# EAGLE design bmp co spg new (EAGLE 9.6.2)
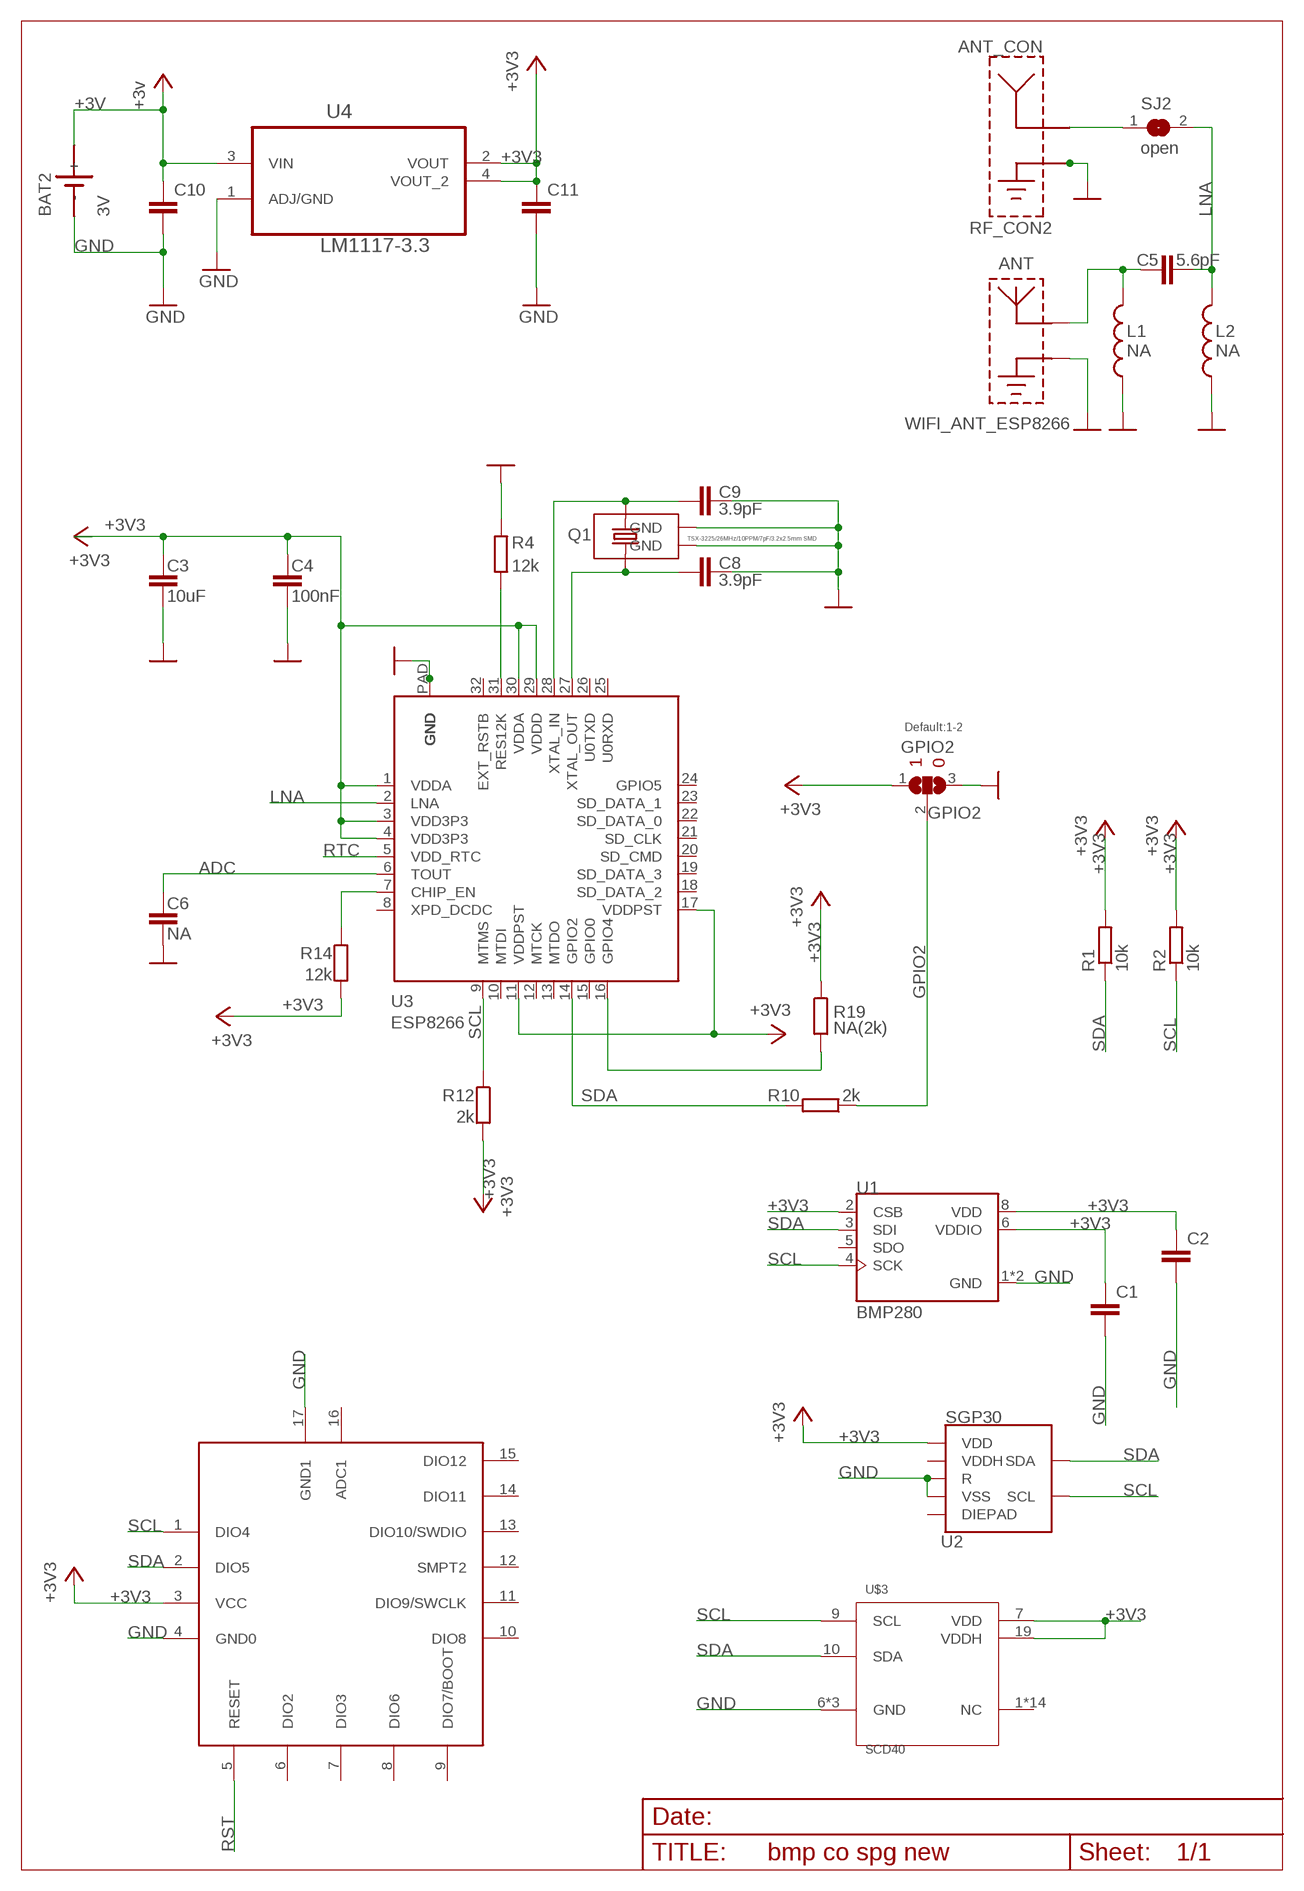
[diagram p0: schematic, sheet 1]

## Parts
ANT  WIFI_ANT_ESP8266  [ESP8266_ANT]
ANT_CON  RF_CON2  [RF_CONNECTOR_I-PEX_NO_CREAM]
BAT2  3V  SN2032  [SN2032]
C1  100nF  C-EUC1206  [C1206]
C2  100nF  C-EUC1206  [C1206]
C3  10uF  C-EUC0603_DWS  [C0603_DWS]
C4  100nF  C-EUC0402_TI  [C0402_TI]
C5  5.6pF  C-EUC0402_TI  [C0402_TI]
C6  NA  C-EUC0402_TI  [C0402_TI]
C8  3.9pF  C-EUC0402_TI  [C0402_TI]
C9  3.9pF  C-EUC0402_TI  [C0402_TI]
C10  47u  C-EUC1206  [C1206]
C11  10u  C-EUC1206  [C1206]
GPIO2  Default:1-2  SJ2W4  [SJ_2_SMALLER]
L1  NA  L-USL0402_TI  [L0402_TI]
L2  NA  L-USL0402_TI  [L0402_TI]
Q1  TSX-3225/26MHz/10PPM/7pF/3.2x2.5mm SMD  SMALL_SMD_CRYSTAL_1  [NX3225SA]
R1  10k  R-EU_R0402  [R0402]
R2  10k  R-EU_R0402  [R0402]
R4  12k  R-EU_R0402_TI  [R0402_TI]
R10  2k  R-EU_R0402_TI  [R0402_TI]
R12  2k  R-EU_R0402_TI  [R0402_TI]
R14  12k  R-EU_R0402_TI  [R0402_TI]
R19  NA(2k)  R-EU_R0402_TI  [R0402_TI]
SJ2  open  SJSJ_SMALLER  [SJ_1_SMALLER]
U1  BMP280  [XDCR_BMP280]
U2  SGP30  [SGP30]
U3  ESP8266  [QFN32_PAD]
U4  LM1117-3.3  [SOT230]
U$1  BLUENRG-234BLEMODULE  [BLUENRG-234BLEMODULE]
U$3  SCD40  [SCD4X]

## Nets
+3V [supply]: BAT2.+ C10.1 U4.3(VIN) ; supply symbol labelled +3v
+3V3 [supply]: C1.1 C2.1 C3.1 C4.1 C11.1 GPIO2.1 R1.2 R2.2 R12.2 R14.2 R19.1 U1.2(CSB) U1.6(VDDIO) U1.8(VDD) U2.1(VDD) U3.1(VDDA) U3.3(VDD3P3) U3.4(VDD3P3) U3.11(VDDPST) U3.17(VDDPST) U3.29(VDDD) U3.30(VDDA) U4.2(VOUT) U4.4(VOUT_2) U$1.3(VCC) U$3.7(VDD) U$3.19(VDDH)
ADC: C6.1 U3.6(TOUT)
GND: ANT.GND ANT_CON.1(GND_1) ANT_CON.2(GND_2) BAT2.- C1.2 C2.2 C3.2 C4.2 C6.2 C8.1 C9.1 C10.2 C11.2 GPIO2.3 L1.1 L2.1 Q1.NC_1(GND) Q1.NC_2(GND) R4.2 U1.1(GND) U1.7(GND) U2.2(VSS) U2.4(R) U3.P$1(GND) U3.P$2(GND) U3.P$3(GND) U3.P$4(GND) U3.P$5(GND) U3.P$6(GND) U3.P$7(GND) U3.P$8(GND) U3.P$9(GND) U3.PAD(GND) U4.1(ADJ/GND) U$1.4(GND0) U$1.17(GND1) U$3.6(GND) U$3.20(GND) U$3.21(GND)
GPIO2: GPIO2.2 R10.1
GPIO4: R19.2 U3.16(GPIO4)
LNA: C5.2 L2.2 SJ2.2 U3.2(LNA)
N$7: ANT_CON.ANT SJ2.1
N$11: R14.1 U3.7(CHIP_EN)
N$14: ANT.ANT C5.1 L1.2
N$21: C8.2 Q1.2 U3.27(XTAL_OUT)
N$22: R4.1 U3.31(RES12K)
N$23: C9.2 Q1.1 U3.28(XTAL_IN)
RST: U$1.5(RESET)
RTC: U3.5(VDD_RTC)
SCL: R2.1 R12.1 U1.4(SCK) U2.6(SCL) U3.9(MTMS) U$1.1(DIO4) U$3.9(SCL)
SDA: R1.1 R10.2 U1.3(SDI) U2.3(SDA) U3.14(GPIO2) U$1.2(DIO5) U$3.10(SDA)
Unconnected: U1.5(SDO) U2.5(VDDH) U2.DIEPAD U3.8(XPD_DCDC) U3.10(MTDI) U3.12(MTCK) U3.13(MTDO) U3.15(GPIO0) U3.18(SD_DATA_2) U3.19(SD_DATA_3) U3.20(SD_CMD) U3.21(SD_CLK) U3.22(SD_DATA_0) U3.23(SD_DATA_1) U3.24(GPIO5) U3.25(U0RXD) U3.26(U0TXD) U3.32(EXT_RSTB) U$1.6(DIO2) U$1.7(DIO3) U$1.8(DIO6) U$1.9(DIO7/BOOT) U$1.10(DIO8) U$1.11(DIO9/SWCLK) U$1.12(SMPT2) U$1.13(DIO10/SWDIO) U$1.14(DIO11) U$1.15(DIO12) U$1.16(ADC1) U$3.1(NC) U$3.2(NC) U$3.3(NC) U$3.4(NC) U$3.5(NC) U$3.8(NC) U$3.11(NC) U$3.12(NC) U$3.13(NC) U$3.14(NC) U$3.15(NC) U$3.16(NC) U$3.17(NC) U$3.18(NC)

## Notes on the sheet
- 1 | 0

## Library data of the parts
ANT = OLIMEX_ANT:WIFI_ANT_ESP8266
ANT_CON = OLIMEX_CONNECTORS:RF_CON
BAT2 = sn2032:SN2032: LI BATTERY
C1 C2 C10 C11 = rcl:C-EU: CAPACITOR, European symbol; SPICEPREFIX: C
C3-C6 C8 C9 = rcl:C-EU: CAPACITOR, European symbol
GPIO2 = jumper:SJ2W: SMD solder JUMPER
L1 L2 = rcl:L-US: INDUCTOR, American symbol
Q1 = OLIMEX_DISCRET:SMALL_SMD_CRYSTAL
R1 R2 = rcl:R-EU_: RESISTOR, European symbol; SPICEPREFIX: R
R4 R10 R12 R14 R19 = rcl:R-EU_: RESISTOR, European symbol
SJ2 = jumper:SJ: SMD solder JUMPER
U1 = BMP280:BMP280: BMP280 Absolute Barometric Pressure Sensor for Battery Powered Devices 2 x 2.5mm Check availability <https://pricing.snapeda.com/parts/BMP280/Bosch/view-part?ref=eda>; AVAILABILITY: In Stock; DESCRIPTION: Pressure Sensor 4.35PSI ~ 15.95PSI (30kPa ~ 110kPa) Absolute - 16b 8-SMD; MF: Bosch; MP: BMP280; PACKAGE: LGA-8 Bosch Tools; PRICE: None; PURCHASE-URL: https://pricing.snapeda.com/search/part/BMP280/?ref=eda
U2 = SGP30:SGP30: The SGP30 is a digital multi-pixel gas sensor designed for easy integration into air purifier, demand-controlled ventilation, and IoT applications. Check availability <https://pricing.snapeda.com/parts/SGP30/Sensirion%20AG/view-part?ref=eda>; AVAILABILITY: In Stock; DESCRIPTION: SGP30, SHTC1 Air Quality, Humidity, Temperature Sensor Arduino Platform Evaluation Expansion Board; MF: Sensirion AG; MP: SGP30; PACKAGE: None; PRICE: None
U3 = OLIMEX_IC:ESP8266
U4 = LM1117-3.3:LM1117-3.3: IC REG LDO 800MA 3.3V Check prices <https://pricing.snapeda.com/parts/LM1117-3.3/Texas%20Instruments/view-part?ref=eda>; AVAILABILITY: In Stock; DESCRIPTION: Linear Voltage Regulator IC Positive Fixed 1 Output 800mA DDPAK/TO-263-3; MF: Texas Instruments; MP: LM1117-3.3; PACKAGE: None; PRICE: None
U$1 = BLUENRG-234blemodule:BLUENRG-234BLEMODULE: BLUENRG-234 BLE Module
U$3 = SCD40-D-R1:SCD40

## Net classes
1 supply: width 0.406 mm, clearance 0.203 mm

## Board
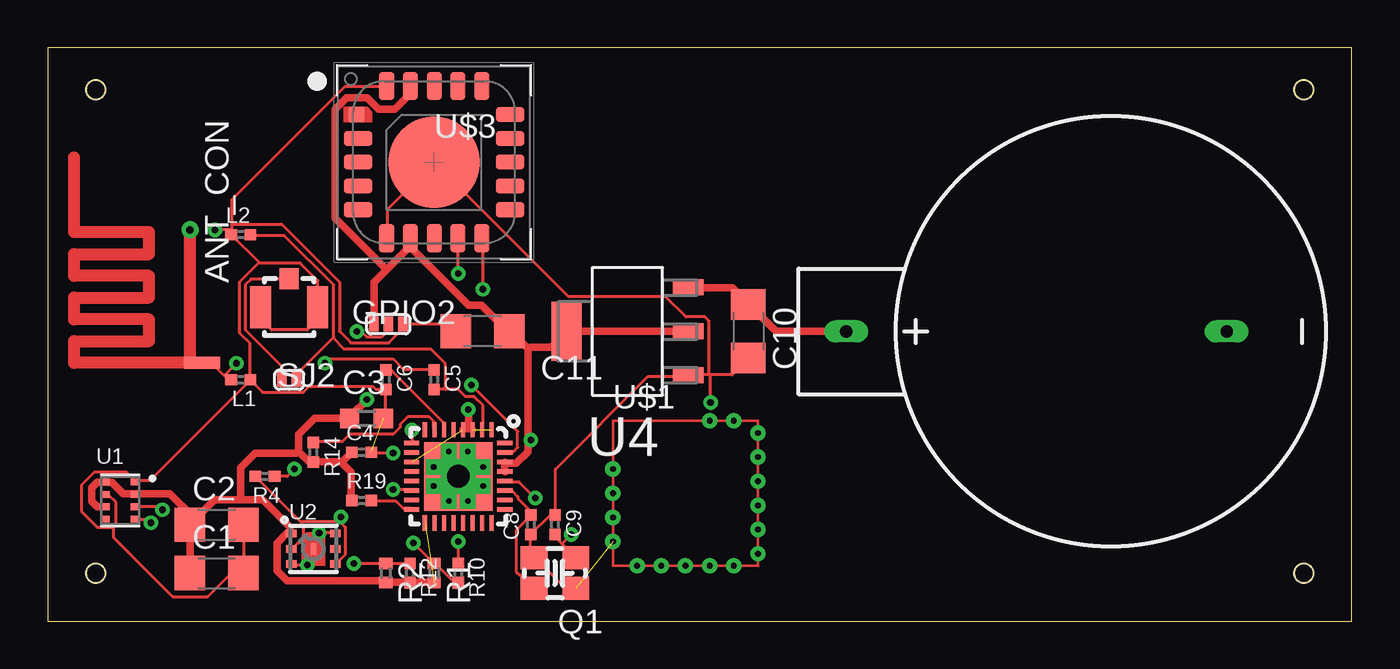
[diagram p1: board, top side]
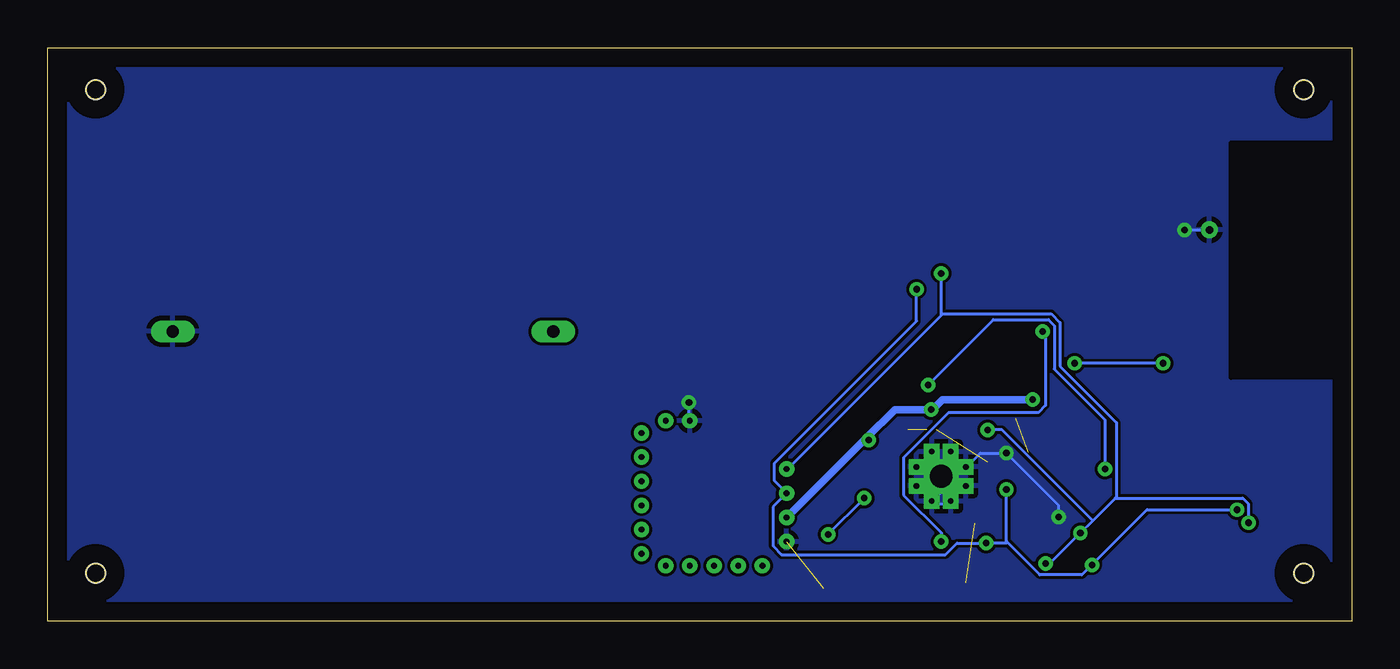
[diagram p2: board, bottom side, seen from below]

Size 68.56 x 30.15 mm. Coordinates in mm from the lower left corner, seen from the top.
Outline: 2.04,2.51 arc174 3.04,2.51 3.04,2.57 arc174 2.04,2.57 2.04,2.51
Outline: 2.04,27.91 arc174 3.04,27.91 3.04,27.97 arc174 2.04,27.97 2.04,27.91
Outline: 65.54,27.91 arc174 66.54,27.91 66.54,27.97 arc174 65.54,27.97 65.54,27.91
Outline: 65.54,2.51 arc174 66.54,2.51 66.54,2.57 arc174 65.54,2.57 65.54,2.51
Outline: 0,30.15 0,0 68.56,0 68.56,30.15 0,30.15
Copper layers (1*16): Top 0.035mm / dielectric 1.5mm / Bottom 0.035mm
Design rules "default": minimum track width 6mil, minimum drill 0.35mm, track to track 6mil, track to pad 6mil, pad to pad 6mil, via to via 6mil, smd to smd 6mil, copper to edge 40mil, drill to drill 6mil, minimum pad ring 10mil, minimum via ring 8mil, stop-mask expansion 4mil, vias tented up to drill 0mil, thermal gap 10mil
Holes 1 mm at 2.54,2.54 2.54,27.94 66.04,27.94 66.04,2.54

### Footprints (pad centres in the part's own frame; a part is rotated, then mirrored left to right if it is on the bottom)
ESP8266_ANT = smd 0.635 x 1.905: ANT -5.334,-3.302 | drill 0.4 pad 0.635: GND 1.651,-2.667
RF_CONNECTOR_I-PEX_NO_CREAM = smd 2.2 x 1.1: 1 0,1.5; 2 0,-1.5 | smd 1.1 x 1: ANT 1.5,0
SN2032 = drill 0.65 long: + 0,13.9; - 0,-6.1
C1206 = smd 1.6 x 1.8: 1 -1.4,0; 2 1.4,0
C0603_DWS = smd 1.016 x 1.016: 1 -0.889,0; 2 0.889,0
C0402_TI = smd 0.61 x 0.584: 1 -0.508,0; 2 0.508,0
SJ_2_SMALLER = smd 0.508 x 0.762: 1 -0.762,0; 2 0,0; 3 0.762,0
L0402_TI = smd 0.61 x 0.584: 1 -0.508,0; 2 0.508,0
NX3225SA = smd 1.4 x 1.2: 1 -1.1,-0.8; 2 1.1,0.8; NC_1 1.1,-0.8; NC_2 -1.1,0.8
R0402 = smd 0.6 x 0.7: 1 -0.5,0; 2 0.5,0
R0402_TI = smd 0.61 x 0.584: 1 -0.508,0; 2 0.508,0
SJ_1_SMALLER = smd 0.508 x 0.762: 1 -0.381,0; 2 0.381,0
XDCR_BMP280 = smd 0.5 x 0.35: 1 0.8,0.975; 2 0.8,0.325; 3 0.8,-0.325; 4 0.8,-0.975; 5 -0.8,-0.975; 6 -0.8,-0.325; 7 -0.8,0.325; 8 -0.8,0.975
SGP30 = smd 0.55 x 0.4: 1 -1.15,0.8; 2 -1.15,0; 3 -1.15,-0.8; 4 1.15,-0.8; 5 1.15,0; 6 1.15,0.8 | smd 0.305 x 0.61: DIEPAD 0,0
QFN32_PAD = smd 0.8 x 0.23: 1 -2.45,1.75; 2 -2.45,1.25; 3 -2.45,0.75; 4 -2.45,0.25; 5 -2.45,-0.25; 6 -2.45,-0.75; 7 -2.45,-1.25; 8 -2.45,-1.75; 17 2.45,-1.75; 18 2.45,-1.25; 19 2.45,-0.75; 20 2.45,-0.25; 21 2.45,0.25; 22 2.45,0.75; 23 2.45,1.25; 24 2.45,1.75 | smd 0.23 x 0.8: 9 -1.75,-2.45; 10 -1.25,-2.45; 11 -0.75,-2.45; 12 -0.25,-2.45; 13 0.25,-2.45; 14 0.75,-2.45; 15 1.25,-2.45; 16 1.75,-2.45; 25 1.75,2.45; 26 1.25,2.45; 27 0.75,2.45; 28 0.25,2.45; 29 -0.25,2.45; 30 -0.75,2.45; 31 -1.25,2.45; 32 -1.75,2.45 | drill 1.2 pad 1.422 square: P$1 0,0 | drill 0.3 pad 0.4 square: P$2 0.5,1.3; P$3 -0.5,1.3; P$4 -1.3,0.5; P$5 -1.3,-0.5; P$6 -0.5,-1.3; P$7 0.5,-1.3; P$8 1.3,-0.5; P$9 1.3,0.5 | smd 3.6 x 3.6: PAD 0,0
SOT230 = smd 1.6 x 0.838: 1 -3.2,2.311; 2 -3.2,0; 3 -3.2,-2.311 | smd 1.6 x 3.099: 4 3.2,0
BLUENRG-234BLEMODULE = drill 0.3 pad 0.813: 1 -3.81,1.27 | drill 0.3: 2 -3.81,0; 3 -3.81,-1.27; 4 -3.81,-2.54; 5 -2.54,-3.81; 6 -1.27,-3.81; 7 0,-3.81; 8 1.27,-3.81; 9 2.54,-3.81; 10 3.81,-3.175; 11 3.81,-1.905; 12 3.81,-0.635; 13 3.81,0.635; 14 3.81,1.905; 15 3.81,3.175; 16 2.54,3.81; 17 1.27,3.81
SCD4X = smd 0.8 x 0.8: 1 -4.075,2.5 | smd 1.5 x 0.8: 2 -4,1.25; 3 -4,0; 4 -4,-1.25; 5 -4,-2.5; 11 4,-2.5; 12 4,-1.25; 13 4,0; 14 4,1.25; 15 4,2.5 | smd 0.8 x 1.5: 6 -2.5,-4; 7 -1.25,-4; 8 0,-4; 9 1.25,-4; 10 2.5,-4; 16 2.5,4; 17 1.25,4; 18 0,4; 19 -1.25,4; 20 -2.5,4 | smd 4.8 x 4.8: 21 0,0

### Placement (x,y rotation side)
ANT  4.83,18.92 90 top
ANT_CON  12.7,16.51 90 top
BAT2  55.88,15.24 90 top
C1  8.89,2.54 0 top
C2  8.89,5.08 0 top
C3  16.76,10.67 0 top
C4  16.51,8.89 0 top
C5  20.32,12.7 270 top
C6  17.78,12.7 270 top
C8  25.4,5.08 90 top
C9  26.67,5.08 270 top
C10  36.83,15.24 270 top
C11  22.86,15.24 180 top
GPIO2  17.91,15.62 0 top
L1  10.16,12.7 180 top
L2  10.16,20.32 0 top
Q1  26.67,2.54 180 top
R1  20.32,2.54 270 top
R2  17.78,2.54 270 top
R4  11.43,7.62 180 top
R10  21.59,2.54 270 top
R12  19.05,2.54 270 top
R14  13.97,8.89 270 top
R19  16.51,6.35 0 top
SJ2  12.7,12.7 0 top
U1  3.81,6.35 0 top
U2  13.97,3.81 0 top
U3  21.59,7.62 270 top
U4  30.48,15.24 180 top
U$1  33.53,6.73 0 top
U$3  20.32,24.13 0 top

### Tracks (layer width: path | path; a pad name or v marks a point on that pad's centre or on a via)
+3V
  Top 0.406: U4.3 33.71,17.53 35.99,17.53 36.83,16.69 C10.1 36.98,16.54 38.28,15.24 BAT2.+
+3V3  (via drill 0.35)  (3 unrouted)
  Top 0.406: 15.49,8.38 R14.2 13.82,8.31 13.21,8.91 | C4.1 15.49,8.38 | R19.1 15.95,6.4 15.95,7.85 15.57,8.23 15.49,8.38 | 13.21,8.91 13.21,9.83 14.05,10.67 C3.1 15.95,10.82 v16.79,11.66 | U1.6 3,6.02 2.62,6.02 2.31,6.33 2.31,7.01 2.62,7.32 3,7.32 U1.8 3.15,7.32 3.38,7.32 3.99,6.71 4.6,6.71 U1.2 4.75,6.71 6.43,6.71 7.64,5.49 C2.1 | R1.2 20.3,2.06 19.07,2.06 R12.2 18.92,2.06 17.78,2.06 R2.2 17.63,2.13 12.6,2.13 12.07,2.67 12.07,4.12 12.6,4.65 U2.1 12.75,4.65 12.75,4.95 11.3,6.4 10.16,6.4 | 10.16,6.4 8.79,6.4 7.49,5.11 C2.1 | C1.1 7.49,2.59 7.49,4.88 C2.1 | 10.16,6.4 10.16,8.08 10.92,8.84 13.06,8.84 13.21,8.91 | 17.82,18.48 19,19.66 19,20.12 U$3.7 19.15,19.58 22.12,16.61 22.81,16.61 24.11,15.32 C11.1 24.33,15.24 25.25,14.33 | 17.82,18.48 17.17,17.83 17.17,15.62 GPIO2.1 | 17.82,18.48 15.11,21.18 15.11,26.9 15.72,27.51 16.79,27.51 17.4,26.9 18.24,26.9 19,27.66 19,28.12 U$3.19 | 22.12,10.13 22.28,10.13 U3.3 | 22.12,10.13 21.89,10.13 U3.4 | v22.12,11.12 22.12,10.13 | U3.29 24.03,7.92 24.03,8.31 U3.30 24.18,8.31 24.64,8.31 25.25,8.91 25.25,9.53 | 25.25,14.33 25.25,9.53 | U4.2 U4.4 27.15,15.09 26.47,14.4 25.4,14.4 25.25,14.33 | v25.4,9.53 25.25,9.53
  Bottom 0.406: 25.51,9.64 29.67,5.49 U$1.3 | 25.51,9.64 24.03,11.12 v22.12,11.12 21.97,11.2 21.51,11.66 v16.79,11.66 | v25.4,9.53 25.51,9.64
ADC
  Top 0.152: C6.1 17.78,13.18 18.09,13.18 20.83,10.44 20.83,10.13 U3.6
GND  (via drill 0.35)  (2 unrouted)
  Top 0.152: U$3.6 17.86,20.19 17.86,21.64 20.3,24.08 U$3.21 27.38,17.07 32.49,17.07 33.55,16 34.54,16 34.77,15.77 34.77,12.95 | 34.85,12.95 35.99,12.95 36.83,13.79 C10.2 | 34.85,12.95 34.77,12.95 | 34.77,12.95 33.71,12.95 U4.1 33.63,12.88 31.57,12.88 26.7,8 26.7,5.64 C9.1 26.62,5.56 26.39,5.56 C8.1 25.4,3.5 25.55,3.35 Q1.NC_1 25.63,3.35 27.23,1.75 27.76,1.75 Q1.NC_2 | R4.2 13.32,5.22 | 13.32,5.22 13.44,5.11 13.44,4.34 13.21,4.12 13.13,4.12 U2.2 | 15.38,5.22 15.34,5.26 13.36,5.26 13.32,5.22 | 15.38,5.22 15.65,4.95 15.65,3.5 15.19,3.05 U2.4 | v18.16,8.84 17.02,8.84 C4.2 | v15.42,5.49 15.42,5.26 15.38,5.22 | C2.2 10.31,5.03 10.31,2.59 C1.2 10.24,2.52 9.63,2.52 8.41,1.29 6.58,1.29 3.45,4.42 3.45,4.95 3.42,4.99 | C11.2 21.44,15.24 21.06,15.62 GPIO2.3 18.62,15.62 18.62,15.32 17.93,14.63 15.95,14.63 15.34,15.24 15.34,17.83 12.29,20.88 9.7,20.88 | 3.42,4.99 3.38,4.95 2.62,4.95 1.78,5.79 1.78,7.16 2.46,7.85 4.14,7.85 4.6,7.39 U1.1 4.67,7.39 5.36,7.39 L1.1 | 3.42,4.99 3.61,5.18 3.61,6.25 3.23,6.63 3.07,6.63 U1.7 | C3.2 17.7,10.67 17.78,10.74 C6.2 17.25,12.19 17.09,12.34 13.74,12.34 13.44,12.04 11.3,12.04 10.69,12.65 L1.1 | 11.11,18.86 11.15,18.82 13.28,18.82 14.2,17.91 14.2,16.54 ANT_CON.2 14.2,16.46 14.2,15.85 13.67,15.32 11.76,15.32 11.23,15.85 11.23,16.46 ANT_CON.1 | 11.11,18.86 L2.1 | 11.11,18.86 10.08,17.83 10.08,15.16 10.62,14.63 10.62,12.72 L1.1 | 9.7,20.57 9.7,20.34 L2.1 | 9.7,20.57 9.7,20.88 | 9.7,20.88 9.7,22.17 15.65,28.12 17.78,28.12 U$3.20 | 9.7,20.57 v8.79,20.57 | 9.7,20.57 L2.1 | v34.85,11.51 34.85,12.95
  Bottom 0.152: U3.P$6 20.22,8.15 19.53,8.84 v18.16,8.84 15.42,6.1 v15.42,5.49 | U3.P$1 21.59,6.78 21.89,6.48 22.28,6.48 22.28,6.4 21.82,6.4 21.82,6.48 21.89,6.55 22.28,6.55 22.35,6.48 22.35,6.17 21.29,6.17 21.13,6.02 20.98,6.02 20.83,6.17 20.83,6.48 20.9,6.55 21.13,6.55 21.21,6.48 21.21,6.4 21.36,6.4 21.36,6.48 21.29,6.55 21.21,6.55 21.13,6.48 21.13,6.33 U3.P$8 | v8.79,20.57 ANT.GND | v34.85,11.51 34.85,10.59 U$1.17
  pour Bottom: -3.81,48.26 -3.81,-3.81 72.39,-3.81 72.39,48.26
GPIO2  (via drill 0.35)
  Top 0.152: v21.59,4.19 R10.1 | v16.26,15.24 16.48,15.24 16.79,14.94 17.55,14.94 17.86,15.24 17.86,15.62 GPIO2.2
  Bottom 0.152: v21.59,4.19 21.59,4.65 23.57,6.63 23.57,8.61 21.21,10.97 16.48,10.97 16.1,11.35 16.1,15.09 v16.26,15.24
GPIO4
  Top 0.152: R19.2 17.02,6.33 18.31,6.33 18.69,5.94 19.07,5.94 U3.16
LNA
  Top 0.152: 20.9,12.19 21.59,12.19 21.97,11.81 22.43,11.81 22.89,11.35 22.89,10.13 U3.2 | 20.9,12.19 C5.2 | 15,14.9 13.13,13.03 13.13,12.72 SJ2.2 | 15,14.9 15.04,14.94 15.04,17.68 12.45,20.27 10.69,20.27 L2.2 | 20.9,12.19 20.9,13.56 20.14,14.33 15.57,14.33 15,14.9
N$7
  Top 0.152: SJ2.1 12.29,12.72 12.29,13.41 10.39,15.32 10.39,17.68 10.69,17.98 12.68,17.98 ANT_CON.ANT
N$11
  Top 0.152: R14.1 13.97,9.45 15.49,9.45 15.88,9.83 18.16,9.83 18.54,10.21 18.54,10.36 18.92,10.74 20.07,10.74 20.3,10.52 20.3,10.13 U3.7
N$14  (via drill 0.35)
  Top 0.152: 9.28,12.92 8.64,13.56 8.18,13.56 ANT.ANT | 9.28,12.92 9.47,12.72 9.63,12.72 L1.2 | v14.58,13.56 14.81,13.79 18.16,13.79 18.69,13.26 20.3,13.26 C5.1 | 9.28,12.92 v9.93,13.56
  Bottom 0.152: v9.93,13.56 v14.58,13.56
N$21
  Top 0.152: U3.27 24.11,6.86 24.41,6.86 24.71,6.55 24.71,6.48 25.4,5.79 C8.2 25.4,5.56 24.64,4.8 24.64,2.59 24.79,2.44 24.87,2.44 25.55,1.75 Q1.2
N$22  (via drill 0.35)
  Top 0.152: R4.1 12.6,7.62 v12.98,8 | v22.28,12.42 24.71,9.98 24.71,9.14 24.49,8.91 24.11,8.91 U3.31
  Bottom 0.152: v12.98,8 12.98,10.59 15.65,13.26 15.65,15.54 15.95,15.85 18.85,15.85 v22.28,12.42
N$23  (via drill 0.35)
  Top 0.152: 27.04,4.08 27.76,3.35 Q1.1 | 27.04,4.08 26.7,4.42 26.7,4.57 C9.2 | v25.63,6.48 24.79,7.32 24.11,7.32 U3.28 | 27.04,4.08 v27.53,4.57
  Bottom 0.152: v27.53,4.57 v25.63,6.48
SCL  (via drill 0.35)
  Top 0.152: R2.1 R12.1 | v5.44,5.18 5.28,5.33 4.67,5.33 U1.4 | v14.28,4.65 15.11,4.65 U2.6 | v19.15,10.06 19.15,9.37 U3.9 | v16.1,3.05 R2.1 | R2.1 | v21.59,18.29 21.59,20.12 U$3.9
  Bottom 0.152: v5.44,5.18 5.44,6.17 5.74,6.48 12.37,6.48 | 12.37,6.48 12.45,6.48 13.63,5.3 | 13.63,5.3 v14.28,4.65 15.88,3.05 v16.1,3.05 | v19.15,10.06 18.39,10.06 13.63,5.3 | 21.59,16.15 21.59,16.08 29.67,8 U$1.1 | 21.59,16.15 v21.59,18.29 | 12.37,6.48 12.37,10.44 15.34,13.41 15.34,15.7 15.8,16.15 21.59,16.15
SDA  (via drill 0.35)
  Top 0.152: R10.2 21.59,2.06 21.36,2.06 20.37,3.05 R1.1 20.3,3.05 v19.23,4.12 | v6.04,5.87 5.89,6.02 4.67,6.02 U1.3 | v13.67,2.97 12.83,2.97 U2.3 | v18.16,6.93 19.07,6.93 U3.14 | v22.89,17.45 22.89,20.12 U$3.10
  Bottom 0.152: v6.04,5.87 10.77,5.87 v13.67,2.97 14.2,2.44 16.41,2.44 18.12,4.15 | v18.16,6.93 18.16,4.19 18.12,4.15 | 18.12,4.15 18.16,4.12 v19.23,4.12 20.75,4.12 21.36,3.5 29.97,3.5 30.43,3.96 30.43,6.02 U$1.2 29.74,6.78 30.35,7.39 30.35,8.31 22.89,15.77 v22.89,17.45